# EAGLE design XLR (EAGLE 6.5.0)
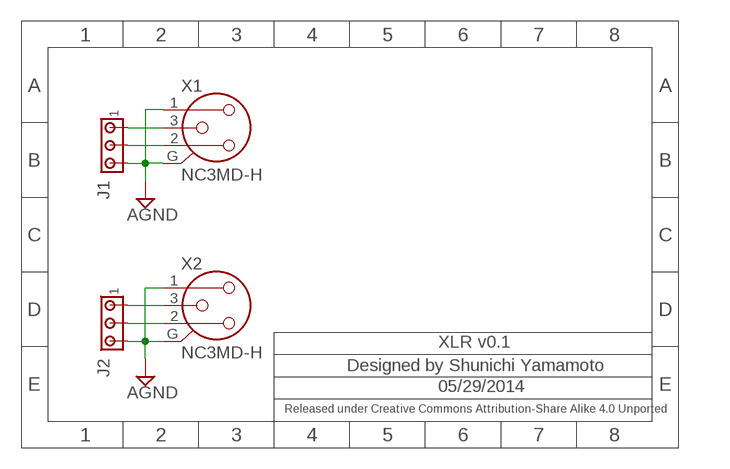
[diagram p0: schematic, sheet 1]

## Parts
J1  MTA03-100  [10X03MTA]
J2  MTA03-100  [10X03MTA]
X1  NC3MD-H  [NC3MD-H]
X2  NC3MD-H  [NC3MD-H]

## Nets
AGND: J1.3 J2.3 X1.1 X1.G X2.1 X2.G
N$1: J1.1 X1.3
N$2: J1.2 X1.2
N$3: J2.1 X2.3
N$4: J2.2 X2.2

## Notes on the sheet
- XLR v0.1
- Designed by Shunichi Yamamoto
- 05/29/2014
- Released under Creative Commons Attribution-Share Alike 4.0 Unported

## Library data of the parts
J1 J2 = con-amp:MTA03-100: AMP connector
X1 X2 = con-neutrik_ag:NC3: Neutrik Audio Connector XLR SERIES Stereo 1/4" jack Source: www.neutrik.com/; MF: NEUTRIK; MPN: NC3MD-H; OC_FARNELL: 1769923; OC_NEWARK: 87F6598

## Board
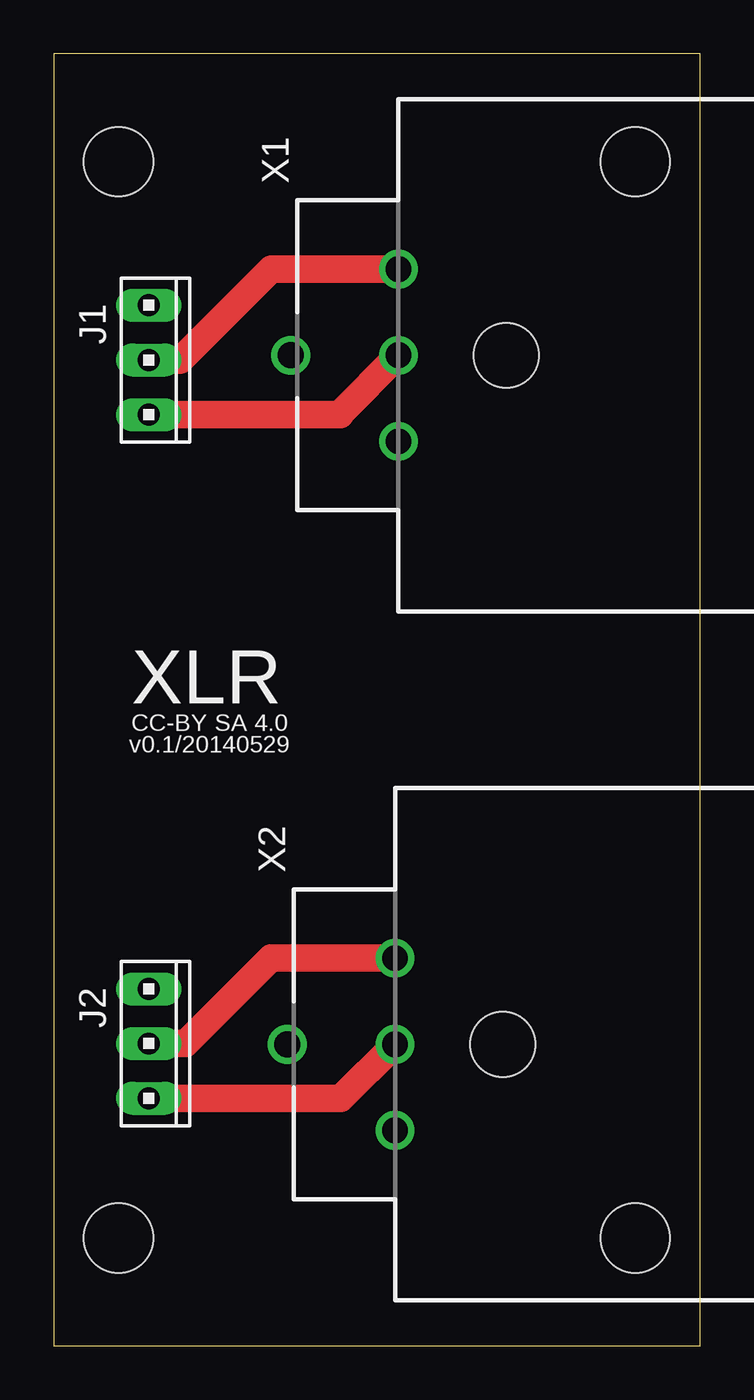
[diagram p1: board, top side]
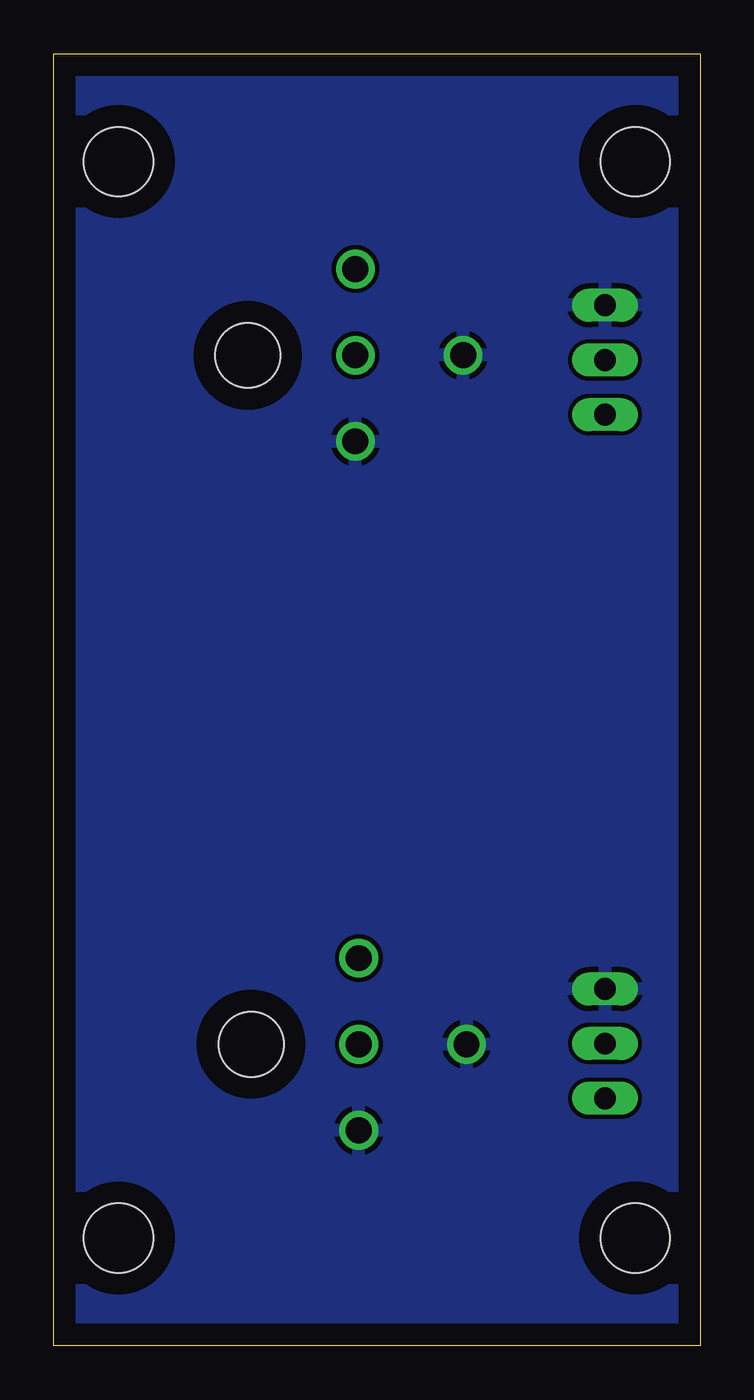
[diagram p2: board, bottom side, seen from below]

Size 30 x 60 mm. Coordinates in mm from the lower left corner, seen from the top.
Outline: 0,0 30,0 30,60 0,60 0,0
Copper layers (1*16): Top 0.035mm / dielectric 1.5mm / Bottom 0.035mm
Design rules "default": minimum track width 10mil, minimum drill 24mil, track to track 8mil, track to pad 8mil, pad to pad 8mil, via to via 8mil, smd to smd 8mil, copper to edge 40mil, drill to drill 8mil, minimum pad ring 10mil, minimum via ring 8mil, stop-mask expansion 4mil, vias tented up to drill 0mil, thermal gap 10mil
Holes 3.2 mm at 3,5 3,55 27,55 27,5

### Footprints (pad centres in the part's own frame; a part is rotated, then mirrored left to right if it is on the bottom)
10X03MTA = drill 1.016 long: 1 2.54,0; 2 0,0; 3 -2.54,0
NC3MD-H = drill 1.2: 1 4,0; 2 -4,0; 3 0,0; G 0,-5 | hole 3: 0,5

### Placement (x,y rotation side)
J1  4.41,45.78 270 top
J2  4.41,14.03 270 top
X1  16,46 270 top
X2  15.84,14 270 top

### Tracks (layer width: path | path; a pad name or v marks a point on that pad's centre or on a via)
AGND
  pour Bottom: 0,0 30,0 30,60 0,60
N$1
  Top 1.27: J1.1 13.3,43.24 13.3,43.3 X1.3
N$2
  Top 1.27: J1.2 5.88,45.78 9.7,49.6 9.88,49.78 10.1,50 X1.2
N$3
  Top 1.27: J2.1 13.33,11.49 X2.3
N$4
  Top 1.27: J2.2 6.13,14.03 10.1,18 X2.2

### Text on the board
tNames: XLR | CC-BY SA 4.0 | v0.1/20140529